# EAGLE schematic Noninvasive Nexmeter (EAGLE 9.5.0)
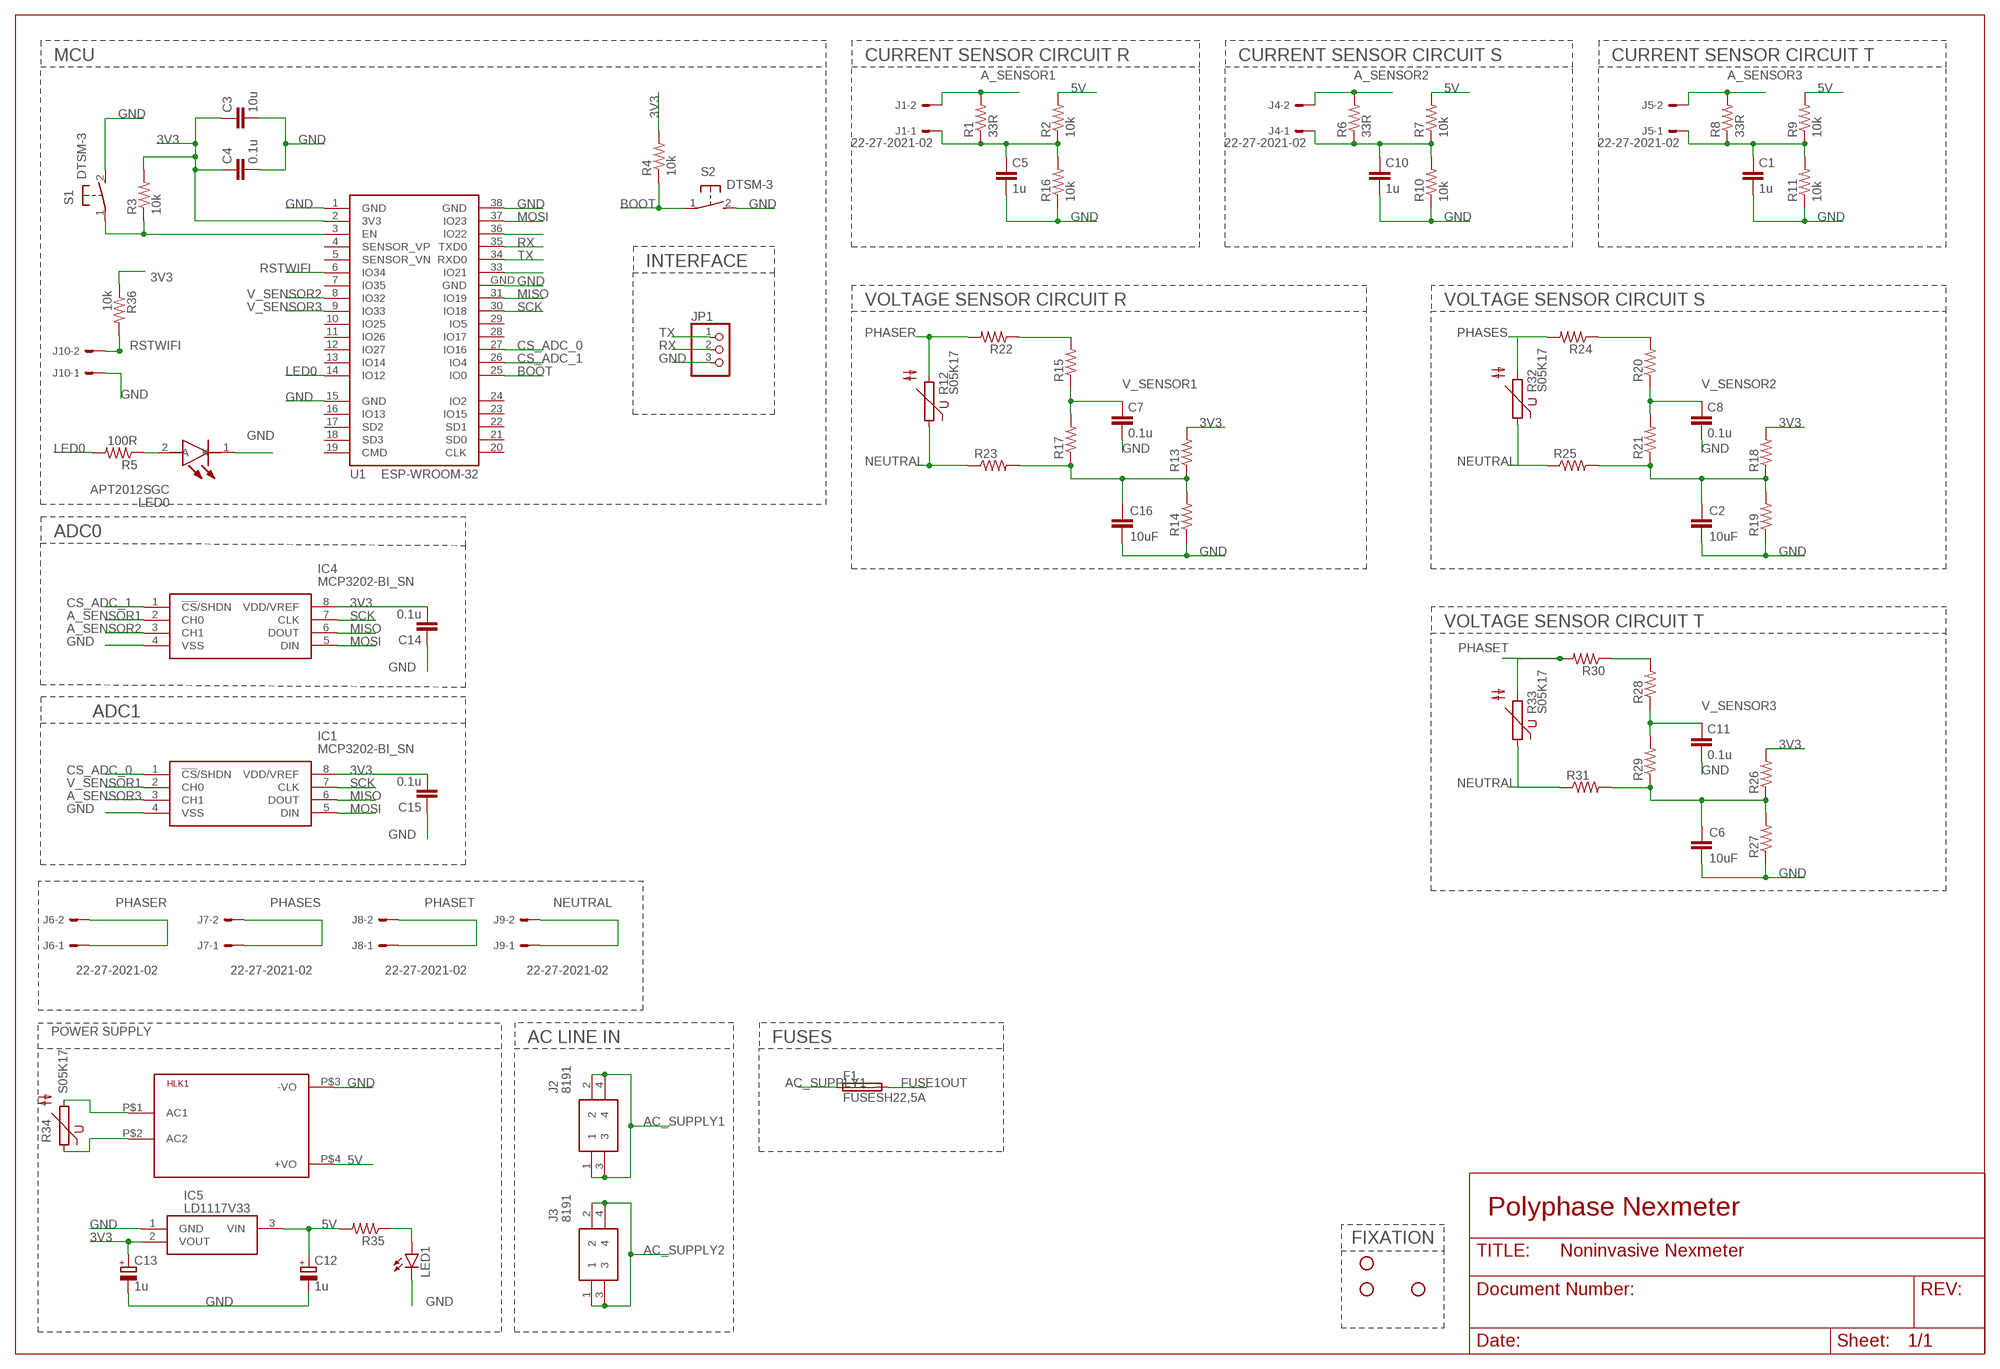
[diagram p0: schematic, sheet 1]

## Parts
C1  1u  C-EUC0805  [C0805]
C2  10uF  RCL_C-EUC0805  [RCL_C0805]
C3  10u  C-EUC0805  [C0805]
C4  0.1u  C-EUC0805  [C0805]
C5  1u  C-EUC0805  [C0805]
C6  10uF  RCL_C-EUC0805  [RCL_C0805]
C7  0.1u  C-EUC0805  [C0805]
C8  0.1u  C-EUC0805  [C0805]
C10  1u  C-EUC0805  [C0805]
C11  0.1u  C-EUC0805  [C0805]
C12  1u  CPOL-EUE1.8-4  [E1,8-4]
C13  1u  CPOL-EUE1.8-4  [E1,8-4]
C14  0.1u  C-EUC0805  [C0805]
C15  0.1u  C-EUC0805  [C0805]
C16  10uF  RCL_C-EUC0805  [RCL_C0805]
F1  FUSESH22,5A  [SH22,5A]
HLK1  HLK-PM013W  [HLK-PM01]
IC1  MCP3202-BI_SN  [SOIC127P600X175-8N]
IC4  MCP3202-BI_SN  [SOIC127P600X175-8N]
IC5  LD1117V33  [TO270P460X1020X2008-3P]
J1  22-27-2021-02  [6410-02]
J2  8191  [8191]
J3  8191  [8191]
J4  22-27-2021-02  [6410-02]
J5  22-27-2021-02  [6410-02]
J6  22-27-2021-02  [6410-02]
J7  22-27-2021-02  [6410-02]
J8  22-27-2021-02  [6410-02]
J9  22-27-2021-02  [6410-02]
J10  22-27-2021-02  [6410-02]
JP1  PINHD-1X3  [1X03]
LED0  APT2012SGC  [LEDC2012X85N]
LED1  LED5MM  [LED5MM]
R1  33R  R-US_R0805  [R0805]
R2  10k  R-US_R0805  [R0805]
R3  10k  R-US_R0805  [R0805]
R4  10k  R-US_R0805  [R0805]
R5  100R  R-US_R0805  [R0805]
R6  33R  R-US_R0805  [R0805]
R7  10k  R-US_R0805  [R0805]
R8  33R  R-US_R0805  [R0805]
R9  10k  R-US_R0805  [R0805]
R10  10k  R-US_R0805  [R0805]
R11  10k  R-US_R0805  [R0805]
R12  S05K17  [S05K17]
R13  RESISTOR0805  [0805]
R14  RESISTOR0805  [0805]
R15  RESISTOR0805  [0805]
R16  10k  R-US_R0805  [R0805]
R17  RESISTOR0805  [0805]
R18  RESISTOR0805  [0805]
R19  RESISTOR0805  [0805]
R20  RESISTOR0805  [0805]
R21  RESISTOR0805  [0805]
R22  RESISTOR0805  [0805]
R23  RESISTOR0805  [0805]
R24  RESISTOR0805  [0805]
R25  RESISTOR0805  [0805]
R26  RESISTOR0805  [0805]
R27  RESISTOR0805  [0805]
R28  RESISTOR0805  [0805]
R29  RESISTOR0805  [0805]
R30  RESISTOR0805  [0805]
R31  RESISTOR0805  [0805]
R32  S05K17  [S05K17]
R33  S05K17  [S05K17]
R34  S05K17  [S05K17]
R35  RESISTOR0805  [0805]
R36  10k  R-US_R0805  [R0805]
S1  DTSM-3  [DTSM-3]
S2  DTSM-3  [DTSM-3]
STANDOFF1  STAND-OFF  [STAND-OFF]
STANDOFF2  STAND-OFF  [STAND-OFF]
STANDOFF4  STAND-OFF  [STAND-OFF]
U1  ESP-WROOM-32  [ESP-WROOM-32]

## Nets
3V3: C3.1 C4.1 C13.+ C14.2 C15.2 IC1.8(VDD/VREF) IC4.8(VDD/VREF) IC5.2(VOUT) R3.2 R4.2 R13.2 R18.2 R26.2 R36.1 U1.2(3V3)
5V: C12.+ HLK1.P$4(+VO) IC5.3(VIN) R2.2 R7.2 R9.2 R35.2
A_SENSOR1: IC4.2(CH0) J1.2 R1.2
A_SENSOR2: IC4.3(CH1) J4.2 R6.2
A_SENSOR3: IC1.3(CH1) J5.2 R8.2
AC_SUPPLY1: F1.1 J2.1 J2.2 J2.3 J2.4
AC_SUPPLY2: HLK1.P$2(AC2) J3.1 J3.2 J3.3 J3.4 R34.1
BOOT: R4.1 S2.1 U1.25(IO0)
CS_ADC_0: IC1.1(!CS!/SHDN) U1.27(IO16)
CS_ADC_1: IC4.1(!CS!/SHDN) U1.26(IO4)
FUSE1OUT: F1.2 HLK1.P$1(AC1) R34.2
GND: C1.2 C2.2 C3.2 C4.2 C5.2 C6.2 C7.2 C8.2 C10.2 C11.2 C12.- C13.- C14.1 C15.1 C16.2 HLK1.P$3(-VO) IC1.4(VSS) IC4.4(VSS) IC5.1(GND) J10.1 JP1.3 LED0.1(K) LED1.K(C) R10.1 R11.1 R14.1 R16.1 R19.1 R27.1 S1.2 S2.2 U1.1(GND) U1.15(GND) U1.38(GND) U1.GND
LED0: R5.2 U1.14(IO12)
MISO: IC1.6(DOUT) IC4.6(DOUT) U1.31(IO19)
MOSI: IC1.5(DIN) IC4.5(DIN) U1.37(IO23)
N$1: R20.2 R24.1
N$2: C1.1 J5.1 R8.1 R9.1 R11.2
N$3: C2.1 R18.1 R19.2 R21.1 R25.2
N$4: LED0.2(A) R5.1
N$5: R3.1 S1.1 U1.3(EN)
N$6: R28.2 R30.1
N$7: R15.2 R22.1
N$8: U1.33(IO21)
N$9: C10.1 J4.1 R6.1 R7.1 R10.2
N$10: C16.1 R13.1 R14.2 R17.1 R23.2
N$11: U1.36(IO22)
N$12: C6.1 R26.1 R27.2 R29.1 R31.2
N$13: LED1.A R35.1
N$16: C5.1 J1.1 R1.1 R2.1 R16.2
NEUTRAL: J9.1 J9.2 R12.1 R23.1 R25.1 R31.1 R32.1 R33.1
PHASER: J6.1 J6.2 R12.2 R22.2
PHASES: J7.1 J7.2 R24.2 R32.2
PHASET: J8.1 J8.2 R30.2 R33.2
RSTWIFI: J10.2 R36.2 U1.6(IO34)
RX: JP1.2 U1.35(TXD0)
SCK: IC1.7(CLK) IC4.7(CLK) U1.30(IO18)
TX: JP1.1 U1.34(RXD0)
V_SENSOR1: C7.1 IC1.2(CH0) R15.1 R17.2
V_SENSOR2: C8.1 R20.1 R21.2 U1.8(IO32)
V_SENSOR3: C11.1 R28.1 R29.2 U1.9(IO33)
Unconnected: U1.4(SENSOR_VP) U1.5(SENSOR_VN) U1.7(IO35) U1.10(IO25) U1.11(IO26) U1.12(IO27) U1.13(IO14) U1.16(IO13) U1.17(SD2) U1.18(SD3) U1.19(CMD) U1.20(CLK) U1.21(SD0) U1.22(SD1) U1.23(IO15) U1.24(IO2) U1.28(IO17) U1.29(IO5)

## Notes on the sheet
- MCU | CURRENT SENSOR CIRCUIT R | CURRENT SENSOR CIRCUIT S | CURRENT SENSOR CIRCUIT T
- INTERFACE
- VOLTAGE SENSOR CIRCUIT R | VOLTAGE SENSOR CIRCUIT S
- ADC0
- VOLTAGE SENSOR CIRCUIT T
- ADC1
- POWER SUPPLY
- AC LINE IN | FUSES
- Polyphase Nexmeter
- FIXATION

## Library data of the parts
C1 C3-C5 C7 C8 C10 C11 C14 C15 = rcl:C-EU: CAPACITOR, European symbol; SPICEPREFIX: C
C2 C6 C16 = ac_monitor:RCL_C-EU: CAPACITOR, European symbol; SPICEPREFIX: C
C12 C13 = rcl:CPOL-EU: POLARIZED CAPACITOR, European symbol; SPICEPREFIX: C
F1 = fuse:FUSE: Fuse; OC_FARNELL: unknown; OC_NEWARK: unknown
HLK1 = HLK-PM01:HLK-PM01: Hi-Link Power Supply HLK-PM01 3W Author: Ahmed Said <https://github.com/AhmedSaid/EAGLELibraries>
IC1 IC4 = SamacSys_Parts:MCP3202-BI_SN: IC, A-D, Converter, 12 bit, SMT, MCP3202BISN Source: Datasheet <https://componentsearchengine.com/Datasheets/1/MCP3202-BI_SN.pdf>; DESCRIPTION: IC, A-D, Converter, 12 bit, SMT, MCP3202BISN; HEIGHT: 1.75mm; MANUFACTURER_NAME: Microchip; MANUFACTURER_PART_NUMBER: MCP3202-BI/SN; MOUSER_PART_NUMBER: 579-MCP3202BISN; MOUSER_PRICE-STOCK: https://www.mouser.com/Search/Refine.aspx?Keyword=579-MCP3202BISN
IC5 = SamacSys_Parts:LD1117V33: 800mA,3.3V,LDO Voltage Reg.,LD1117V33 STMicroelectronics LD1117V33, LDO Voltage Regulator, 1.3A, 3.3 V +/-1%, 3-Pin TO-220 Source: Datasheet <https://componentsearchengine.com/Datasheets/1/LD1117V33.pdf>; DESCRIPTION: 800mA,3.3V,LDO Voltage Reg.,LD1117V33 STMicroelectronics LD1117V33, LDO Voltage Regulator, 1.3A, 3.3 V +/-1%, 3-Pin TO-220; HEIGHT: 4.6mm; MANUFACTURER_NAME: STMicroelectronics; MANUFACTURER_PART_NUMBER: LD1117V33; MOUSER_PART_NUMBER: 511-LD1117V33; MOUSER_PRICE-STOCK: https://www.mouser.com/Search/Refine.aspx?Keyword=511-LD1117V33
J1 J4-J10 = con-molex:22-?-02: CONNECTOR wire to board 2.54 mm (.1 inch) pitch header; MF: MOLEX; OC_FARNELL: unknown; OC_NEWARK: unknown
J2 J3 = SamacSys_Parts:8191: Screw terminal, PC mount, vertical, with screw, metal, 15 Amps Source: Datasheet <https://componentsearchengine.com/Datasheets/1/8191.pdf>; DESCRIPTION: Screw terminal, PC mount, vertical, with screw, metal, 15 Amps; HEIGHT: 6.56mm; MANUFACTURER_NAME: Keystone Electronics; MANUFACTURER_PART_NUMBER: 8191; MOUSER_PART_NUMBER: 534-8191; MOUSER_PRICE-STOCK: https://www.mouser.com/Search/Refine.aspx?Keyword=534-8191
JP1 = pinhead:PINHD-1X3: PIN HEADER
LED0 = SamacSys_Parts:APT2012SGC: 2.5 V Green LED 2012 (0805) SMD, Kingbright APT2012SGC Source: Datasheet <https://componentsearchengine.com/Datasheets/1/APT2012SGC.pdf>; DESCRIPTION: 2.5 V Green LED 2012 (0805) SMD, Kingbright APT2012SGC; HEIGHT: 0.85mm; MANUFACTURER_NAME: Kingbright; MANUFACTURER_PART_NUMBER: APT2012SGC; MOUSER_PART_NUMBER: 604-APT2012SGC; MOUSER_PRICE-STOCK: https://www.mouser.com/Search/Refine.aspx?Keyword=604-APT2012SGC
LED1 = led:LED: LED OSRAM: - CHIPLED LG R971, LG N971, LY N971, LG Q971, LY Q971, LO R971, LY R971 LH N974, LH R974 LS Q976, LO Q976, LY Q976 LO Q996 - Hyper CHIPLED LW Q18S LB Q993, LB Q99A, LB R99A - SideLED LS A670, LO A670, LY A670, LG A670, LP A670 LB A673, LV A673, LT A673, LW A673 LH A674 LY A675 LS A676, LA A676, LO A676, LY A676, LW A676 LS A679, LY A679, LG A679 - Hyper Micro SIDELED® LS Y876, LA Y876, LO Y876, LY Y876 LT Y87S - SmartLED LW L88C, LW L88S LB L89C, LB L89S, LG L890 LS L89K, LO L89K, LY L89K LS L896, LA L896, LO L896, LY L896 - TOPLED LS T670, LO T670, LY T670, LG T670, LP T670 LSG T670, LSP T670, LSY T670, LOP T670, LYG T670 LG T671, LOG T671, LSG T671 LB T673, LV T673, LT T673, LW T673 LH T674 LS T676, LA T676, LO T676, LY T676, LB T676, LH T676, LSB T676, LW T676 LB T67C, LV T67C, LT T67C, LS T67K, LO T67K, LY T67K, LW E67C LS E67B, LA E67B, LO E67B, LY E67B, LB E67C, LV E67C, LT E67C LW T67C LS T679, LY T679, LG T679 LS T770, LO T770, LY T770, LG T770, LP T770 LB T773, LV T773, LT T773, LW T773 LH T774 LS E675, LA E675, LY E675, LS T675 LS T776, LA T776, LO T776, LY T776, LB T776 LHGB T686 LT T68C, LB T68C - Hyper Mini TOPLED® LB M676 - Mini TOPLED Santana® LG M470 LS M47K, LO M47K, LY M47K Source: http://www.osram.convergy.de LUXEON: - LUMILED® LXK2-PW12-R00, LXK2-PW12-S00, LXK2-PW14-U00, LXK2-PW14-V00 LXK2-PM12-R00, LXK2-PM12-S00, LXK2-PM14-U00 LXK2-PE12-Q00, LXK2-PE12-R00, LXK2-PE12-S00, LXK2-PE14-T00, LXK2-PE14-U00 LXK2-PB12-K00, LXK2-PB12-L00, LXK2-PB12-M00, LXK2-PB14-N00, LXK2-PB14-P00, LXK2-PB14-Q00 LXK2-PR12-L00, LXK2-PR12-M00, LXK2-PR14-Q00, LXK2-PR14-R00 LXK2-PD12-Q00, LXK2-PD12-R00, LXK2-PD12-S00 LXK2-PH12-R00, LXK2-PH12-S00 LXK2-PL12-P00, LXK2-PL12-Q00, LXK2-PL12-R00 Source: www.luxeon.com KINGBRIGHT: KA-3528ASYC Source: www.kingbright.com
R1-R11 R16 R36 = rcl:R-US_: RESISTOR, American symbol; SPICEPREFIX: R
R12 R32-R34 = varistor:S05K17: VARISTOR
R13-R15 R17-R31 R35 = SparkFun-Resistors:RESISTOR: Generic Resistor Package
S1 S2 = switch-tact:DTSM-3
STANDOFF1 STANDOFF2 STANDOFF4 = SparkFun-Hardware:STAND-OFF: Stand Off Drill holes for mechanically mounting via screws, standoffs, etc. Note: Use the keepout ring to avoid running the screw head into surrounding components. Variant Overviews STAND-OFF - Mechanical footprint for a #4 phillips button head screw. STAND-OFF-TIGHT - Mechanical footprint for a #4 phillips button head screw, Example SparkFun Products Screw - Phillips Head (1/4", 4-40, 10 pack) <https://www.sparkfun.com/products/10453> (PRT-10453) Screw - Phillips Head (1/2", 4-40, 10 pack) <https://www.sparkfun.com/products/10452> (PRT-10452) Screw - Phillips Head (3/4", 4-40, 10 pack) <https://www.sparkfun.com/products/10451> (PRT-10451) Screw - Phillips Head (1", 4-40, 10 pack) <https://www.sparkfun.com/products/10450> (PRT-10450)
U1 = esp32:ESP-WROOM-32: Espressif Systems ESP-WROOM-32